# EAGLE design MoogFilter DIL (EAGLE 9.5.2)
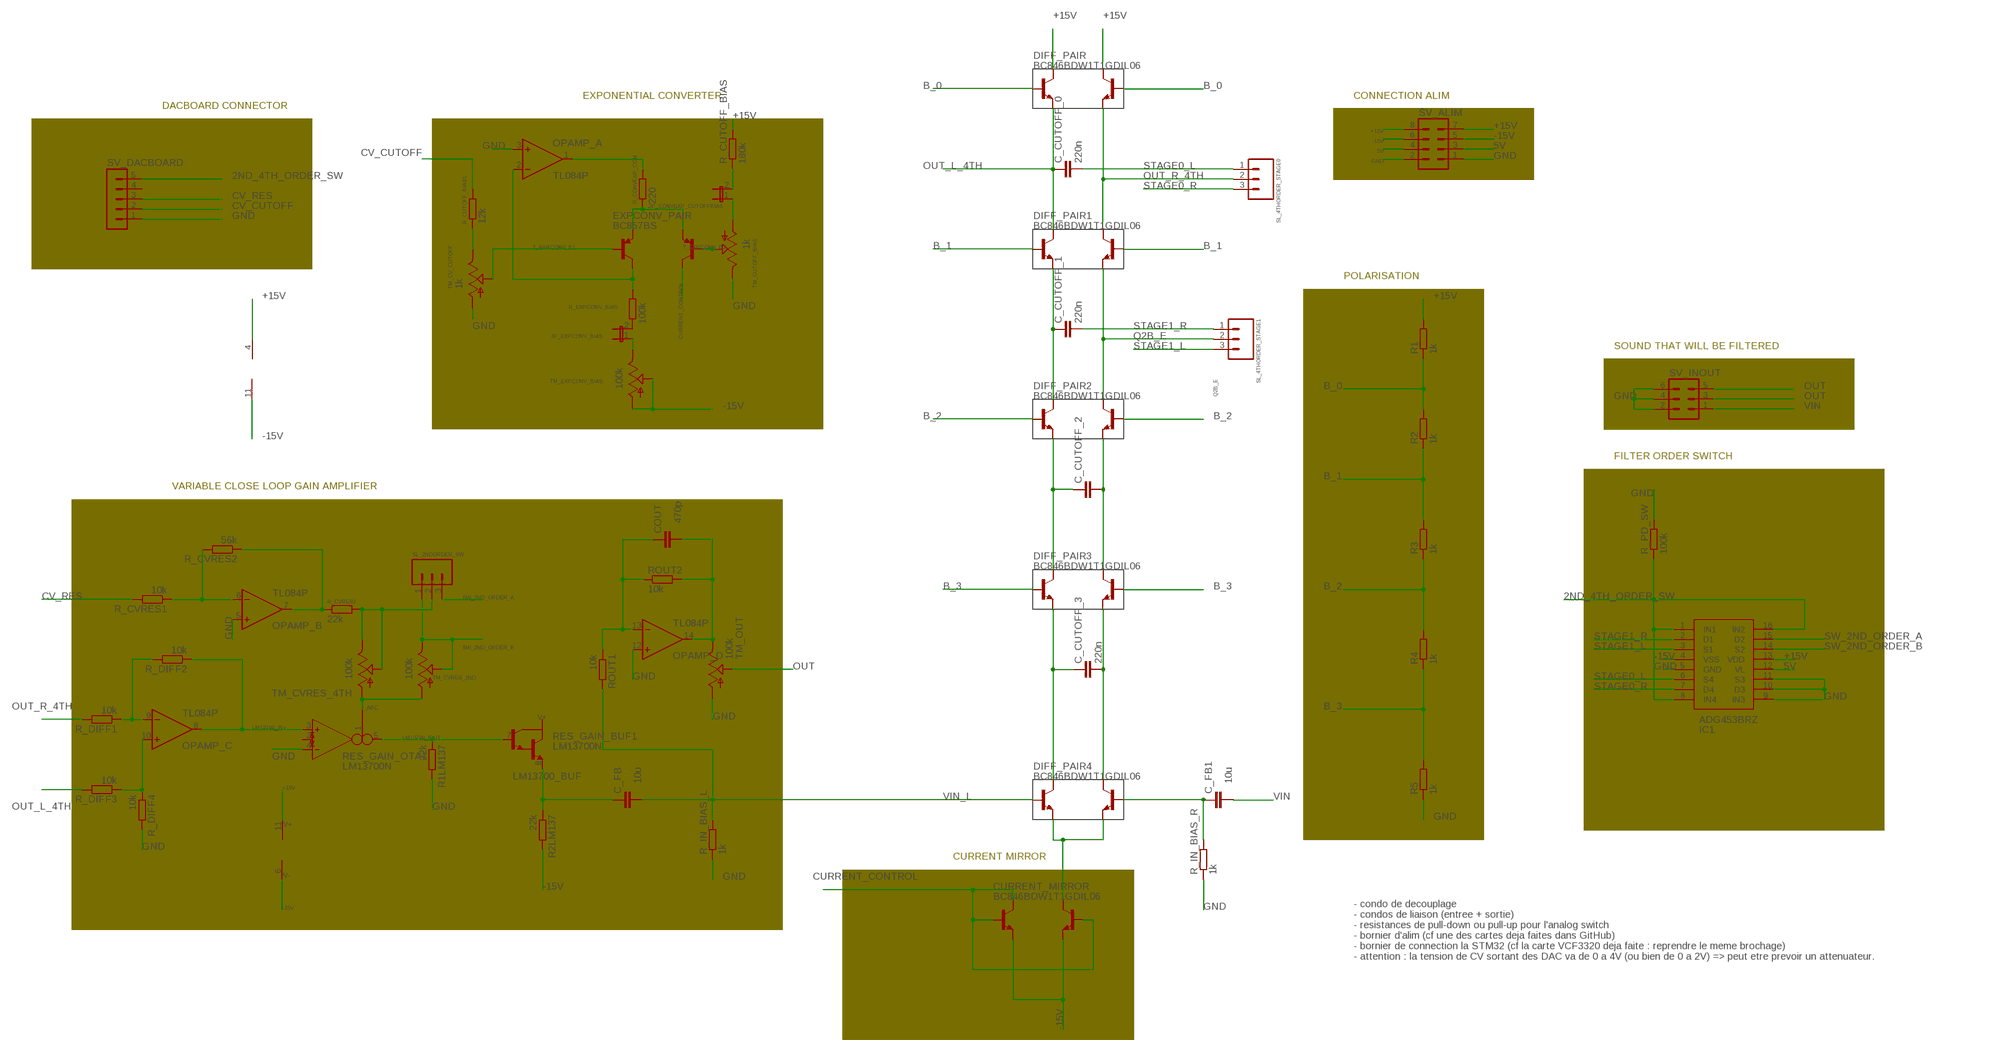
[diagram p0: schematic, sheet 1]

## Parts
C_CUTOFF_0  220n  C5/3  [C5B3]
C_CUTOFF_1  220n  C5/2.5  [C5B2.5]
C_CUTOFF_2  220n  C5/2.5  [C5B2.5]
C_CUTOFF_3  220n  C5/2.5  [C5B2.5]
C_FB  10u  C5/2.5  [C5B2.5]
C_FB1  10u  C5/2.5  [C5B2.5]
COUT  470p  C5/2.5  [C5B2.5]
CURRENT_MIRROR  BC846BDW1T1GDIL06  [DIL06]
DIFF_PAIR  BC846BDW1T1GDIL06  [DIL06]
DIFF_PAIR1  BC846BDW1T1GDIL06  [DIL06]
DIFF_PAIR2  BC846BDW1T1GDIL06  [DIL06]
DIFF_PAIR3  BC846BDW1T1GDIL06  [DIL06]
DIFF_PAIR4  BC846BDW1T1GDIL06  [DIL06]
EXPCONV_PAIR  BC857BS  [DIL06]
IC1  ADG453BRZ  [SOIC127P600X175-16N]
JP_CONVEXP_CUTOFFBIAS  JP1E  [JP1]
JP_EXPCONV_BIAS  JP1E  [JP1]
OPAMP_  TL084P  [DIL14]
R1  1k  R-EU_0204/7  [0204/7]
R1LM137  22k  R-EU_0204/7  [0204/7]
R2  1k  R-EU_0204/7  [0204/7]
R2LM137  22k  R-EU_0204/7  [0204/7]
R3  1k  R-EU_0204/7  [0204/7]
R4  1k  R-EU_0204/7  [0204/7]
R5  1k  R-EU_0204/7  [0204/7]
R_CONVEXP_COM  220  R-EU_0204/7  [0204/7]
R_CUTOFF_BIAS  180k  R-EU_0204/7  [0204/7]
R_CUTOFF_BIAS1  12k  R-EU_0204/7  [0204/7]
R_CVRES1  10k  R-EU_0204/7  [0204/7]
R_CVRES2  56k  R-EU_0204/7  [0204/7]
R_CVRES3  22k  R-EU_0204/7  [0204/7]
R_DIFF1  10k  R-EU_0204/7  [0204/7]
R_DIFF2  10k  R-EU_0204/7  [0204/7]
R_DIFF3  10k  R-EU_0204/7  [0204/7]
R_DIFF4  10k  R-EU_0204/7  [0204/7]
R_EXPCONV_BIAS  100k  R-EU_0204/7  [0204/7]
R_IN_BIAS_L  1k  R-EU_0204/7  [0204/7]
R_IN_BIAS_R  1k  R-EU_0204/7  [0204/7]
R_PD_SW  100k  R-EU_0204/7  [0204/7]
RES_GAIN_  LM13700N  [DIL16]
ROUT1  10k  R-EU_0204/7  [0204/7]
ROUT2  10k  R-EU_0204/7  [0204/7]
SL_2NDORDER_SW  MA03  [03P]
SL_4THORDER_STAGE0  MA03  [03P]
SL_4THORDER_STAGE1  MA03  [03P]
SV_ALIM  MA04-2  [MA04-2]
SV_DACBOARD  MA05-1  [MA05-1]
SV_INOUT  MA03-2  [MA03-2]
TM_CUTOFF_BIAS  1k  TRIM  [6MM]
TM_CV_CUTOFF  1k  TRIM  [6MM]
TM_CVRES_2ND  100k  TRIM  [6MM]
TM_CVRES_4TH  100k  TRIM  [6MM]
TM_EXPCONV_BIAS  100k  TRIM  [6MM]
TM_OUT  100k  TRIM  [6MM]

## Nets
2ND_4TH_ORDER_SW: IC1.1(IN1) IC1.8(IN4) IC1.16(IN2) R_PD_SW.1 SV_DACBOARD.5
5V: IC1.12(VL) SV_ALIM.3 SV_ALIM.4
+15V: DIFF_PAIR.3(C1) DIFF_PAIR.6(C2) IC1.13(VDD) OPAMP_.4(P:V+) R1.2 R_CUTOFF_BIAS.2 RES_GAIN_.11(SUPPLY:V+) SV_ALIM.7 SV_ALIM.8
-15V: CURRENT_MIRROR.1(E2) CURRENT_MIRROR.4(E1) IC1.4(VSS) OPAMP_.11(P:V-) R2LM137.2 RES_GAIN_.6(SUPPLY:V-) SV_ALIM.5 SV_ALIM.6 TM_EXPCONV_BIAS.A TM_EXPCONV_BIAS.S
B_0: DIFF_PAIR.2(B2) DIFF_PAIR.5(B1) R1.1 R2.2
B_1: DIFF_PAIR1.2(B2) DIFF_PAIR1.5(B1) R2.1 R3.2
B_2: DIFF_PAIR2.2(B2) DIFF_PAIR2.5(B1) R3.1 R4.2
B_3: DIFF_PAIR3.2(B2) DIFF_PAIR3.5(B1) R4.1 R5.2
CURRENT_CONTROL: CURRENT_MIRROR.2(B2) CURRENT_MIRROR.3(C1) CURRENT_MIRROR.5(B1) EXPCONV_PAIR.3(C2)
CV_CUTOFF: R_CUTOFF_BIAS1.2 SV_DACBOARD.2
CV_RES: R_CVRES1.2 SV_DACBOARD.3
GND: IC1.5(GND) IC1.9(IN3) IC1.10(D3) IC1.11(S3) OPAMP_.3(A:+IN) OPAMP_.5(B:+IN) OPAMP_.12(D:+IN) R1LM137.2 R5.1 R_DIFF4.2 R_IN_BIAS_L.1 R_IN_BIAS_R.1 R_PD_SW.2 RES_GAIN_.4(OTA1:IN_N) SV_ALIM.1 SV_ALIM.2 SV_DACBOARD.1 SV_INOUT.2 SV_INOUT.4 SV_INOUT.6 TM_CUTOFF_BIAS.E TM_CV_CUTOFF.A TM_OUT.A
I_ABC: RES_GAIN_.1(OTA1:I_BIAS) TM_CVRES_2ND.A TM_CVRES_4TH.A
LM13700_BUF: C_FB.1 R2LM137.1 RES_GAIN_.8(BUF1:E)
LM13700_IN+: OPAMP_.8(C:OUT) R_DIFF2.1 RES_GAIN_.3(OTA1:IN_P)
LM13700_IOUT: R1LM137.1 RES_GAIN_.5(OTA1:OUT) RES_GAIN_.7(BUF1:B)
N$1: COUT.1 OPAMP_.13(D:-IN) ROUT1.1 ROUT2.1
N$2: EXPCONV_PAIR.1(E1) EXPCONV_PAIR.4(E2) R_CONVEXP_COM.1
N$3: JP_CONVEXP_CUTOFFBIAS.2 R_CUTOFF_BIAS.1
N$4: OPAMP_.1(A:OUT) R_CONVEXP_COM.2
N$9: JP_CONVEXP_CUTOFFBIAS.1 TM_CUTOFF_BIAS.A
N$10: CURRENT_MIRROR.6(C2) DIFF_PAIR4.1(E2) DIFF_PAIR4.4(E1)
N$11: EXPCONV_PAIR.6(C1) OPAMP_.2(A:-IN) R_EXPCONV_BIAS.2
N$13: JP_EXPCONV_BIAS.2 R_EXPCONV_BIAS.1
N$14: OPAMP_.6(B:-IN) R_CVRES1.1 R_CVRES2.2
N$16: OPAMP_.7(B:OUT) R_CVRES2.1 R_CVRES3.1
N$18: OPAMP_.10(C:+IN) R_DIFF3.1 R_DIFF4.1
N$20: OPAMP_.9(C:-IN) R_DIFF1.1 R_DIFF2.2
N$24: COUT.2 OPAMP_.14(D:OUT) ROUT2.2 TM_OUT.E
N$25: JP_EXPCONV_BIAS.1 TM_EXPCONV_BIAS.E
N$26: R_CVRES3.2 SL_2NDORDER_SW.2 TM_CVRES_4TH.E TM_CVRES_4TH.S
N$29: R_CUTOFF_BIAS1.1 TM_CV_CUTOFF.E
OUT: SV_INOUT.3 SV_INOUT.5 TM_OUT.S
OUT_L_4TH: C_CUTOFF_0.1 DIFF_PAIR1.3(C1) DIFF_PAIR.4(E1) R_DIFF3.2
OUT_R_4TH: DIFF_PAIR1.6(C2) DIFF_PAIR.1(E2) R_DIFF1.2 SL_4THORDER_STAGE0.2
Q2A_E: C_CUTOFF_1.1 DIFF_PAIR1.4(E1) DIFF_PAIR2.3(C1)
Q2B_E: DIFF_PAIR1.1(E2) DIFF_PAIR2.6(C2) SL_4THORDER_STAGE1.2
Q3A_E: C_CUTOFF_2.1 DIFF_PAIR2.4(E1) DIFF_PAIR3.3(C1)
Q3B_E: C_CUTOFF_2.2 DIFF_PAIR2.1(E2) DIFF_PAIR3.6(C2)
Q4A_E: C_CUTOFF_3.1 DIFF_PAIR3.4(E1) DIFF_PAIR4.3(C1)
Q4B_E: C_CUTOFF_3.2 DIFF_PAIR3.1(E2) DIFF_PAIR4.6(C2)
STAGE0_L: C_CUTOFF_0.2 IC1.6(S4) SL_4THORDER_STAGE0.1
STAGE0_R: IC1.7(D4) SL_4THORDER_STAGE0.3
STAGE1_L: IC1.3(S1) SL_4THORDER_STAGE1.3
STAGE1_R: C_CUTOFF_1.2 IC1.2(D1) SL_4THORDER_STAGE1.1
SW_2ND_ORDER_A: IC1.15(D2) SL_2NDORDER_SW.3
SW_2ND_ORDER_B: IC1.14(S2) SL_2NDORDER_SW.1 TM_CVRES_2ND.E TM_CVRES_2ND.S
T_EXPCONV_B1: EXPCONV_PAIR.2(B1) TM_CV_CUTOFF.S
T_EXPCONV_B2: EXPCONV_PAIR.5(B2) TM_CUTOFF_BIAS.S
VIN: C_FB1.2 SV_INOUT.1
VIN_L: C_FB.2 DIFF_PAIR4.5(B1) R_IN_BIAS_L.2 ROUT1.2
VIN_R: C_FB1.1 DIFF_PAIR4.2(B2) R_IN_BIAS_R.2
Unconnected: RES_GAIN_.2(OTA1:I_DIODE) RES_GAIN_.9(BUF2:E) RES_GAIN_.10(BUF2:B) RES_GAIN_.12(OTA2:OUT) RES_GAIN_.13(OTA2:IN_N) RES_GAIN_.14(OTA2:IN_P) RES_GAIN_.15(OTA2:I_DIODE) RES_GAIN_.16(OTA2:I_BIAS) SV_DACBOARD.4

## Notes on the sheet
- EXPONENTIAL CONVERTER | CONNECTION ALIM
- DACBOARD CONNECTOR
- POLARISATION
- SOUND THAT WILL BE FILTERED
- Jumpers here allow, once opened, 
  on-circuit trimmer values measurement.
- FILTER ORDER SWITCH
- VARIABLE CLOSE LOOP GAIN AMPLIFIER | SWITCHER
- SWITCHER | SWITCHER | SWITCHER
- 1 and 4 are closed with input HIGH
  2 and 3 are closed with input LOW
  
  Control is LOW => 2ND ORDER
  Control is HIGH => 4TH ORDER
- CURRENT MIRROR
- - condo de decouplage
  - condos de liaison (entree + sortie)
  - resistances de pull-down ou pull-up pour l'analog switch
  - bornier d'alim (cf une des cartes deja faites dans GitHub)
  - bornier de connection la STM32 (cf la carte VCF3320 deja faite : reprendre le meme brochage)
  - attention : la tension de CV sortant des DAC va de 0 a 4V (ou bien de 0 a 2V) => peut etre prevoir un attenuateur.

## Library data of the parts
C_CUTOFF_0 C_CUTOFF_1-C_CUTOFF_3 C_FB C_FB1 COUT = capacitor-wima:C: CAPACITOR naming: grid - package width
CURRENT_MIRROR DIFF_PAIR DIFF_PAIR1-DIFF_PAIR4 = paires_diff:BC846BDW1T1G
EXPCONV_PAIR = paires_diff:BC857BS
IC1 = ADG453BRZ:ADG453BRZ: Analog Devices ADG453BRZ, Analogue SPST Switch Quad SPST, 9 V, 16-Pin SOIC Source: Datasheet <http://uk.rs-online.com/web/p/products/0412539P>; DESCRIPTION: Analog Devices ADG453BRZ, Analogue SPST Switch Quad SPST, 9 V, 16-Pin SOIC; HEIGHT: 1.75mm; MANUFACTURER_NAME: Analog Devices; MANUFACTURER_PART_NUMBER: ADG453BRZ; MOUSER_PART_NUMBER: 584-ADG453BRZ; MOUSER_PRICE-STOCK: https://www.mouser.com/Search/Refine.aspx?Keyword=584-ADG453BRZ; RS_PART_NUMBER: 0412539P; RS_PRICE-STOCK: http://uk.rs-online.com/web/p/products/0412539P
JP_CONVEXP_CUTOFFBIAS JP_EXPCONV_BIAS = jumper:JP1E: JUMPER
OPAMP_ = linear:TL084: OP AMP
R1 R1LM137 R2 R2LM137 R3-R5 R_CONVEXP_COM R_CUTOFF_BIAS R_CUTOFF_BIAS1 R_CVRES1-R_CVRES3 R_DIFF1-R_DIFF4 R_EXPCONV_BIAS R_IN_BIAS_L R_IN_BIAS_R R_PD_SW ROUT1 ROUT2 = rcl:R-EU_: RESISTOR, European symbol; SPICEPREFIX: R
RES_GAIN_ = ota:LM13700: Dual OTA with buffers
SL_2NDORDER_SW SL_4THORDER_STAGE0 SL_4THORDER_STAGE1 = con-amp-quick:MA03: AMP QUICK CONNECTOR; OC_FARNELL: unknown; OC_NEWARK: unknown
SV_ALIM = con-lstb:MA04-2: PIN HEADER; OC_FARNELL: unknown; OC_NEWARK: unknown
SV_DACBOARD = con-lstb:MA05-1: PIN HEADER; OC_FARNELL: unknown; OC_NEWARK: unknown
SV_INOUT = con-lstb:MA03-2: PIN HEADER; OC_FARNELL: unknown; OC_NEWARK: unknown
TM_CUTOFF_BIAS TM_CV_CUTOFF TM_CVRES_2ND TM_CVRES_4TH TM_EXPCONV_BIAS TM_OUT = adafruit:TRIM

## Board
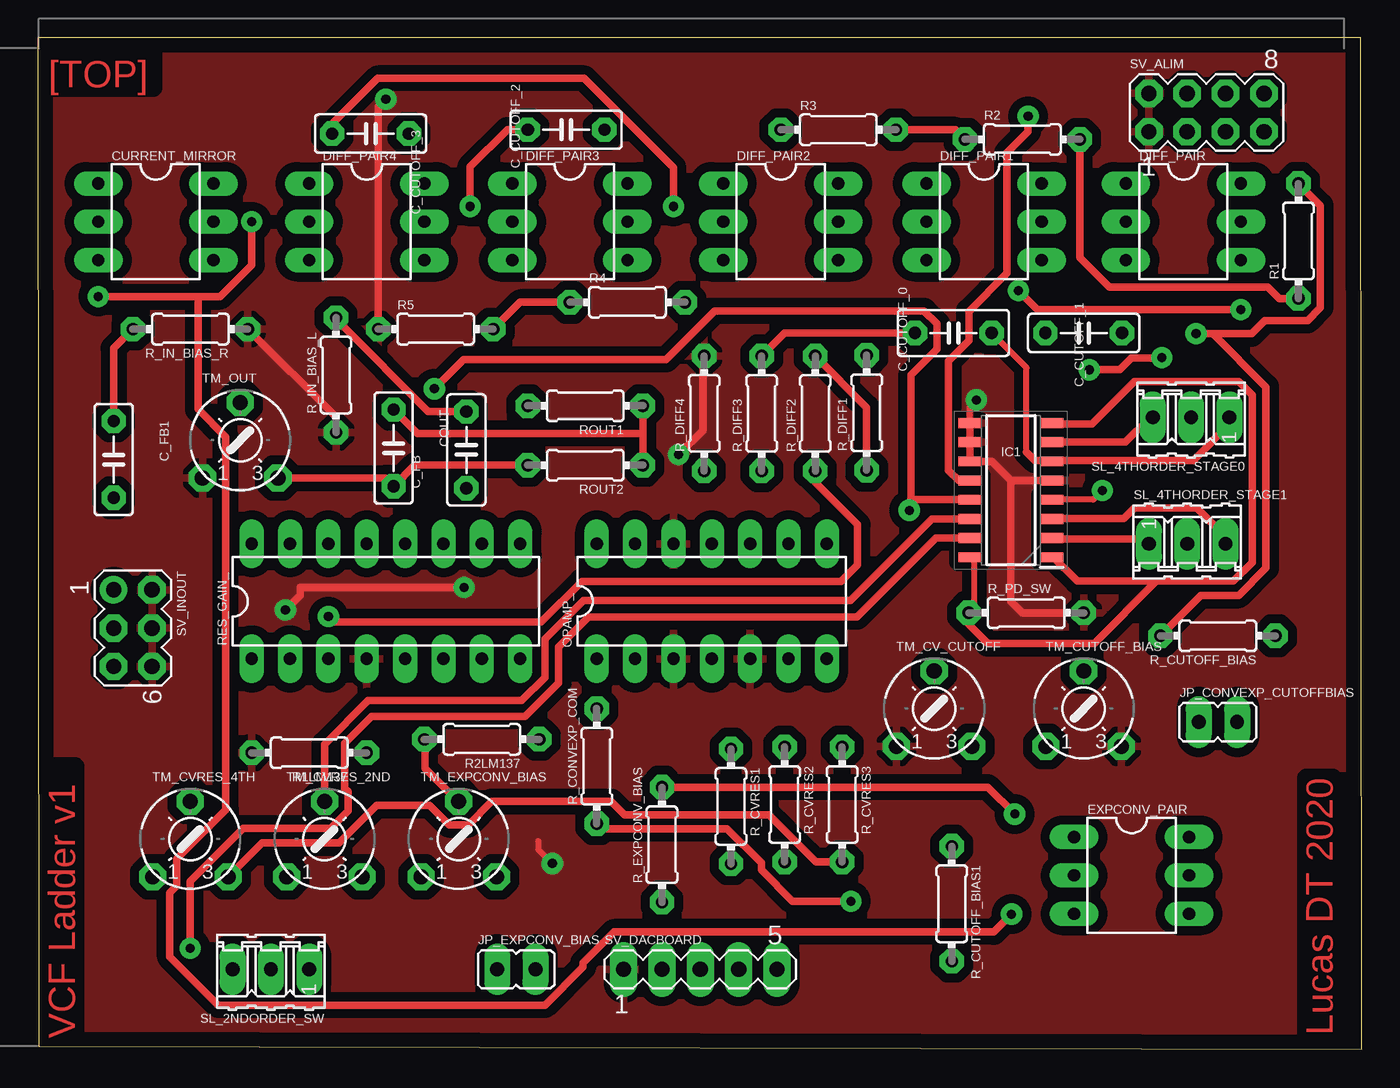
[diagram p1: board, top side]
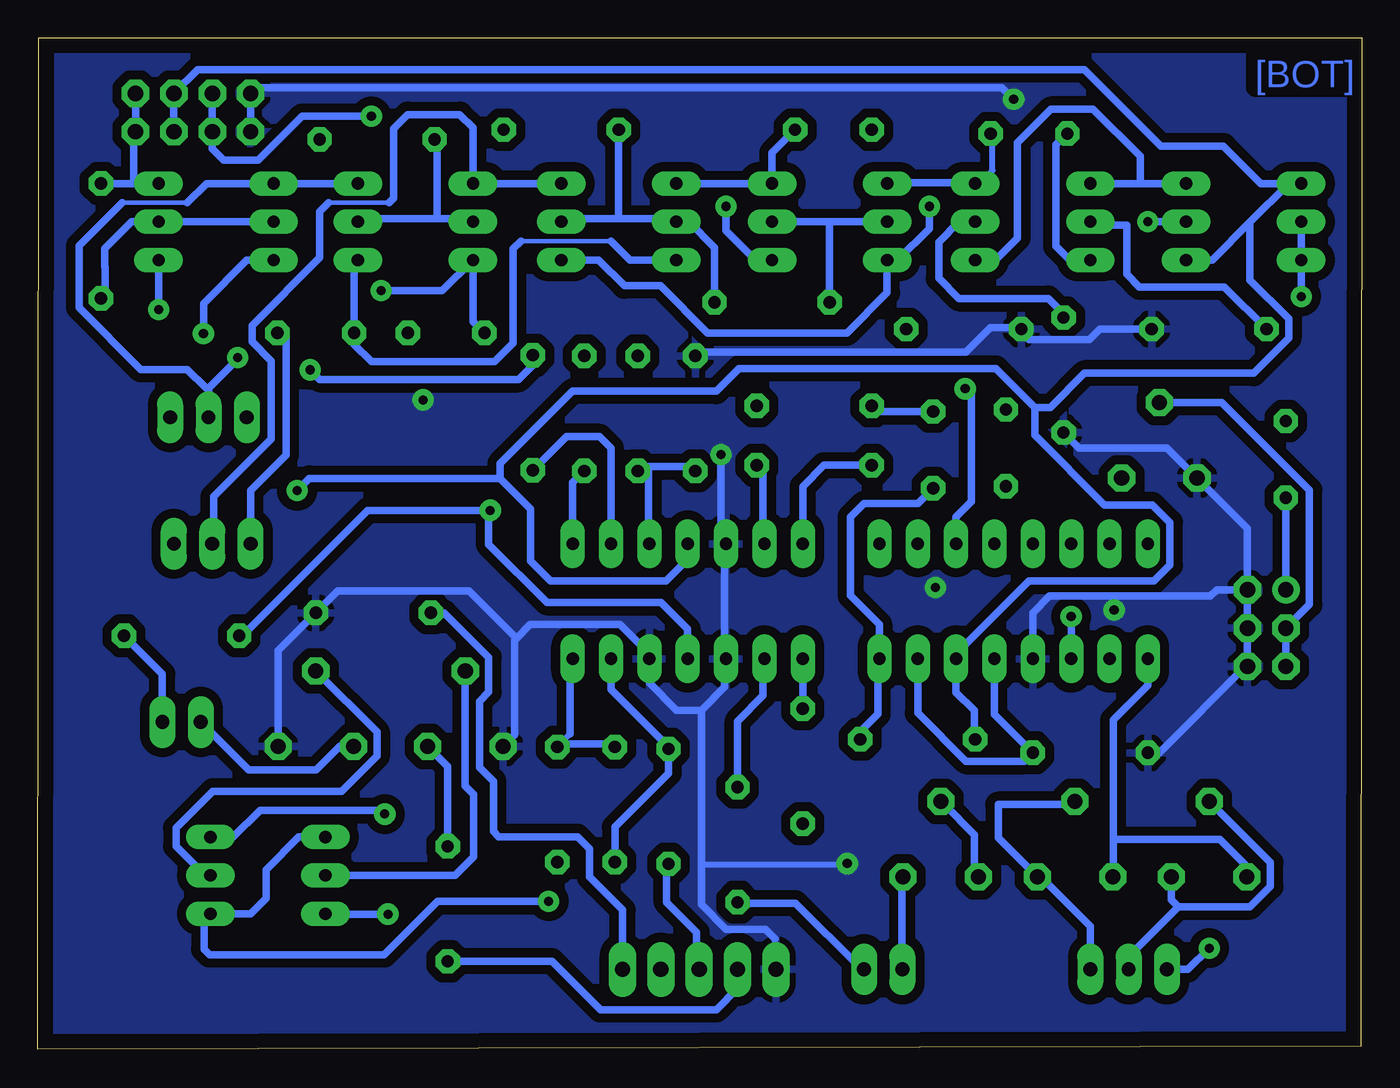
[diagram p2: board, bottom side, seen from below]

Size 87.71 x 67.01 mm. Coordinates in mm from the lower left corner, seen from the top.
Outline: 0.08,0.2 87.71,0 87.64,67.01 0,67.01 0.08,0.2
Copper layers (1*16): Top 0.035mm / dielectric 1.5mm / Bottom 0.035mm
Design rules "ENSEA_2019": minimum track width 0.4mm, minimum drill 0.6mm, track to track 0.4mm, track to pad 0.4mm, pad to pad 0.4mm, via to via 0.4mm, smd to smd 0.4mm, copper to edge 1mm, drill to drill 0.4mm, minimum pad ring 0.4mm, minimum via ring 0.4mm, stop-mask expansion 4mil, vias tented up to drill 0mil, thermal gap 0.4mm

### Footprints (pad centres in the part's own frame; a part is rotated, then mirrored left to right if it is on the bottom)
C5B3 = drill 0.813 pad 1.6 octagon: 1 -2.54,0; 2 2.54,0
C5B2.5 = drill 0.813 pad 1.6 octagon: 1 -2.54,0; 2 2.54,0
DIL06 = drill 0.813 long: 1 -2.54,-3.81; 2 0,-3.81; 3 2.54,-3.81; 4 2.54,3.81; 5 0,3.81; 6 -2.54,3.81
SOIC127P600X175-16N = smd 1.525 x 0.65: 1 -2.712,4.445; 2 -2.712,3.175; 3 -2.712,1.905; 4 -2.712,0.635; 5 -2.712,-0.635; 6 -2.712,-1.905; 7 -2.712,-3.175; 8 -2.712,-4.445; 9 2.712,-4.445; 10 2.712,-3.175; 11 2.712,-1.905; 12 2.712,-0.635; 13 2.712,0.635; 14 2.712,1.905; 15 2.712,3.175; 16 2.712,4.445
JP1 = drill 0.914 long: 1 0,-1.27; 2 0,1.27
DIL14 = drill 0.813 long: 1 -7.62,-3.81; 2 -5.08,-3.81; 3 -2.54,-3.81; 4 0,-3.81; 5 2.54,-3.81; 6 5.08,-3.81; 7 7.62,-3.81; 8 7.62,3.81; 9 5.08,3.81; 10 2.54,3.81; 11 0,3.81; 12 -2.54,3.81; 13 -5.08,3.81; 14 -7.62,3.81
0204/7 = drill 0.813 octagon: 1 -3.81,0; 2 3.81,0
DIL16 = drill 0.813 long: 1 -8.89,-3.81; 2 -6.35,-3.81; 3 -3.81,-3.81; 4 -1.27,-3.81; 5 1.27,-3.81; 6 3.81,-3.81; 7 6.35,-3.81; 8 8.89,-3.81; 9 8.89,3.81; 10 6.35,3.81; 11 3.81,3.81; 12 1.27,3.81; 13 -1.27,3.81; 14 -3.81,3.81; 15 -6.35,3.81; 16 -8.89,3.81
03P = drill 0.914 long: 1 -2.54,0; 2 0,0; 3 2.54,0
MA04-2 = drill 1.016 octagon: 1 -3.81,-1.27; 2 -3.81,1.27; 3 -1.27,-1.27; 4 -1.27,1.27; 5 1.27,-1.27; 6 1.27,1.27; 7 3.81,-1.27; 8 3.81,1.27
MA05-1 = drill 1.016 long: 1 -5.08,0; 2 -2.54,0; 3 0,0; 4 2.54,0; 5 5.08,0
MA03-2 = drill 1.016: 1 -2.54,-1.27 | drill 1.016 octagon: 2 -2.54,1.27; 3 0,-1.27; 4 0,1.27; 5 2.54,-1.27; 6 2.54,1.27
6MM = drill 1 pad 1.676 octagon: A -2.5,-2.5; E 2.5,-2.5; S 0,2.5

### Placement (x,y rotation side)
C_CUTOFF_0  60.66,47.45 0 top
C_CUTOFF_1  69.29,47.45 0 top
C_CUTOFF_2  35,60.91 0 top
C_CUTOFF_3  22.05,60.66 0 top
C_FB  28.4,39.7 90 top
C_FB1  5.03,39.07 270 top
COUT  23.57,39.83 270 top
CURRENT_MIRROR  7.82,54.81 270 top
DIFF_PAIR  75.9,54.81 270 top
DIFF_PAIR1  62.69,54.81 270 top
DIFF_PAIR2  49.23,54.81 270 top
DIFF_PAIR3  35.26,54.81 270 top
DIFF_PAIR4  21.79,54.81 270 top
EXPCONV_PAIR  72.47,11.51 270 top
IC1  64.47,37.03 180 top
JP_CONVEXP_CUTOFFBIAS  78.18,21.67 270 top
JP_EXPCONV_BIAS  31.7,5.28 270 top
OPAMP_  44.65,29.67 0 top
R1  83.52,53.54 90 top
R1LM137  17.98,19.63 180 top
R2  65.23,60.27 0 top
R2LM137  29.41,20.52 180 top
R3  53.04,60.91 0 top
R4  39.07,49.48 0 top
R5  26.37,47.7 0 top
R_CONVEXP_COM  37.03,18.75 90 top
R_CUTOFF_BIAS  78.18,27.38 180 top
R_CUTOFF_BIAS1  60.55,9.63 270 top
R_CVRES1  45.92,16.08 270 top
R_CVRES2  49.48,16.21 270 top
R_CVRES3  53.29,16.21 270 top
R_DIFF1  54.91,42.16 90 top
R_DIFF2  51.51,42.11 90 top
R_DIFF3  47.96,42.11 90 top
R_DIFF4  44.15,42.11 90 top
R_EXPCONV_BIAS  41.35,13.54 90 top
R_IN_BIAS_L  19.76,44.65 90 top
R_IN_BIAS_R  10.11,47.7 180 top
R_PD_SW  65.48,28.91 0 top
RES_GAIN_  23.06,29.67 0 top
ROUT1  36.27,42.62 180 top
ROUT2  36.27,38.68 180 top
SL_2NDORDER_SW  15.44,5.28 180 top
SL_4THORDER_STAGE0  76.4,41.86 180 top
SL_4THORDER_STAGE1  76.15,33.48 0 top
SV_ALIM  77.42,62.05 0 top
SV_DACBOARD  43.89,5.28 0 top
SV_INOUT  6.3,27.89 270 top
TM_CUTOFF_BIAS  69.29,22.56 0 top
TM_CV_CUTOFF  59.39,22.56 0 top
TM_CVRES_2ND  19,13.92 0 top
TM_CVRES_4TH  10.11,13.92 0 top
TM_EXPCONV_BIAS  27.89,13.92 0 top
TM_OUT  13.41,40.34 0 top

### Tracks (layer width: path | path; a pad name or v marks a point on that pad's centre or on a via)
2ND_4TH_ORDER_SW
  Top 0.4: R_PD_SW.1 62.06,29 62.06,32.6 IC1.16 | 66.86,32.6 IC1.1 67.26,32.6 | 67.26,41.4 IC1.8
  Top 0.508: 67.26,41.4 69.82,41.4 72.65,44.23 79.57,44.23 80.45,43.34 80.45,32.25 79.21,31 74.12,31 | 74.12,31 68.86,31 67.26,32.6 | R_PD_SW.1 61.67,28.14 62.94,26.87 69.99,26.87 74.12,31
  Bottom 0.508: SV_DACBOARD.5 48.97,9.22 50.66,10.91 51.15,11.4 51.15,13.26 51.96,14.07 57.18,14.07 57.53,14.43 57.53,17.74 58.44,18.65 58.44,23.04 57.83,23.65 57.83,25.95 60.78,28.91 R_PD_SW.1
5V  (via drill 0.6)
  Top 0.4: 61.66,37.8 IC1.12
  Top 0.508: v65.61,61.8 65.61,60.78 64.21,59.39 64.21,51.39 61.68,48.87 61.68,46.93 60.34,45.59 60.34,38.34 61.01,37.67 IC1.12
  Bottom 0.508: SV_ALIM.4 SV_ALIM.3 76.15,59.64 75.39,58.88 73.1,58.88 70.18,61.8 v65.61,61.8
+15V  (via drill 0.6)
  Top 0.508: v26.28,43.75 28.22,45.7 41.63,45.7 44.84,48.91 58.72,48.91 59.58,48.05 59.58,46.37 57.86,44.65 57.86,36.37 | 57.86,36.37 57.86,35.82 v57.73,35.7 | R1.2 84.98,55.89 84.98,49.13 84.12,48.27 81.29,48.27 80.42,47.4 v76.74,47.4 v76.73,47.4 77.83,47.4 81.36,43.87 81.36,31.87 79.56,30.07 77.06,30.07 R_CUTOFF_BIAS.2 | 57.86,36.37 57.89,36.4 IC1.13
  Bottom 0.508: SV_ALIM.8 SV_ALIM.7 81.36,60.66 81.36,57.35 | OPAMP_.4 44.65,27.83 46.43,29.6 53.98,29.6 57.83,33.45 57.83,35.6 v57.73,35.7 65.85,35.7 74.17,27.38 R_CUTOFF_BIAS.2 | DIFF_PAIR.3 73.86,52.27 76.73,49.4 v76.73,47.4 | R1.2 81.36,57.35 | 81.36,57.35 DIFF_PAIR.6 | RES_GAIN_.11 26.87,35.26 25.86,36.27 25.86,43.33 v26.28,43.75
-15V  (via drill 0.6)
  Top 0.4: 25.66,20.24 R2LM137.2 | 27.66,16.6 TM_EXPCONV_BIAS.S | v70.53,37 69.92,36.4 IC1.4
  Top 0.508: 25.66,20.24 25.66,18.6 27.66,16.6
  Bottom 0.4: 25.66,20.64 R2LM137.2 | TM_EXPCONV_BIAS.S 27.66,16.2
  Bottom 0.508: 57.08,37.8 69.73,37.8 v70.53,37 | 57.08,37.8 55.07,35.8 55.07,32.33 53.75,31 46.1,31 44.65,32.45 OPAMP_.11 | 27.66,16.2 25.66,14.2 25.66,11.69 TM_EXPCONV_BIAS.A | SV_ALIM.5 SV_ALIM.6 77.13,64.88 18.36,64.88 13.31,59.83 9.16,59.83 6.68,57.35 CURRENT_MIRROR.1 4.82,57.35 7.4,54.77 | 25.66,20.64 25.66,22.43 26.87,23.64 RES_GAIN_.6 26.87,26.19 22.06,31 13.78,31 12.71,32.07 12.71,34.89 13.88,36.06 17.04,36.06 21.66,40.67 21.66,42.52 | 21.66,42.52 24.24,45.1 41.25,45.1 42.76,43.59 52.27,43.59 57.08,38.78 57.08,37.8 | 7.4,54.77 9.9,52.27 CURRENT_MIRROR.4 | 7.4,54.77 7.4,50.96 4.84,48.4 4.84,47.1 7.16,44.78 18.36,44.78 20.63,42.52 21.66,42.52
B_0
  Top 0.508: R1.1 82.26,49.73 81.49,50.5 70.99,50.5 69.04,52.45 R2.2
  Bottom 0.4: 79.66,55 DIFF_PAIR.5
  Bottom 0.508: R1.1 83.26,49.8 83.26,51.8 83.26,51.81 83.26,53.04 81.48,54.81 DIFF_PAIR.5 DIFF_PAIR.2
B_1
  Top 0.508: R2.1 60.78,60.91 R3.2
  Bottom 0.4: 66.46,55 DIFF_PAIR1.5 | R2.1 61.26,60.12
  Bottom 0.508: 66.46,55 61.26,55 | 61.26,55 59.26,55 DIFF_PAIR1.2 | 61.26,60.12 61.26,55
B_2
  Bottom 0.4: 52.86,55 DIFF_PAIR2.5 | 45.66,55 DIFF_PAIR2.2
  Bottom 0.508: 45.66,55 49.23,55 | 49.23,55 52.86,55 | 49.23,55 R3.1 | DIFF_PAIR2.2 44.58,54.81 42.88,53.11 R4.2
B_3
  Top 0.508: R4.1 31.95,49.48 R5.2
  Bottom 0.508: DIFF_PAIR3.5 35.26,54.81 | 35.26,54.81 DIFF_PAIR3.2 | 35.26,54.81 R4.1
CURRENT_CONTROL  (via drill 0.6)
  Top 0.508: v4.01,49.86 10.62,49.86 | v64.51,8.94 63.33,7.75 38.16,7.75 36.13,5.72 36.13,5.45 33.6,2.92 11.96,2.92 8.76,6.12 8.76,10.37 9.2,10.81 9.2,12.6 12.47,15.86 12.47,40.55 10.62,42.4 10.62,49.86 | 10.62,49.86 12.09,49.86 14.17,51.94 v14.17,54.81
  Bottom 0.508: v64.51,8.94 68.63,8.94 EXPCONV_PAIR.3 | v14.17,54.81 CURRENT_MIRROR.5 | CURRENT_MIRROR.2 CURRENT_MIRROR.3 v4.01,49.86
CV_CUTOFF
  Bottom 0.508: SV_DACBOARD.2 41.35,4.01 42.75,2.62 50.44,2.62 53.65,5.82 R_CUTOFF_BIAS1.2
CV_RES
  Bottom 0.4: 44.06,5.4 SV_DACBOARD.3
  Bottom 0.508: 44.06,5.4 44.06,7.73 46.06,9.73 46.06,12.2 R_CVRES1.2
GND  (via drill 0.6)
  Top 0.4: 44.06,45.8 R_DIFF4.2 | v34.09,12.29 33.17,13.21 33.17,13.79 | v16.41,29.08 16.46,29.13 16.48,29.13 | IC1.9 61.75,42.59 v62.18,43.01
  Top 0.508: IC1.5 67.17,37.68 64.46,37.68 | 44.06,45.8 44.06,40.98 v42.46,39.38 | 64.46,37.68 63.2,38.94 IC1.11 IC1.10 IC1.9 | R_IN_BIAS_R.1 19.76,41.86 R_IN_BIAS_L.1 | 64.46,37.68 64.47,37.67 64.47,29.67 65.23,28.91 R_PD_SW.2 | R5.1 22.56,62.44 v23.06,62.94 | v16.41,29.08 17.37,30.05 17.37,30.58 v28.25,30.58
  Bottom 0.4: 71.66,20.17 TM_CUTOFF_BIAS.E | 42.2,25.95 OPAMP_.3 | 42.46,33.8 OPAMP_.12 | 38.86,7.32 38.86,5.4 SV_DACBOARD.1 | 7.66,30.2 SV_INOUT.2 | 7.66,25.4 SV_INOUT.6 | 20.06,41 R_IN_BIAS_L.1 | 22.46,47.4 R5.1 22.86,47.8 | R_PD_SW.2 69.29,29.37 | 43.75,12.24 34.14,12.24 v34.09,12.29 | 16.28,30.01 16.41,29.88 v16.41,29.08 | v62.18,43.01 62.18,43.05
  Bottom 0.508: OPAMP_.12 42.2,33.46 42.2,25.95 42.2,23.99 43.75,22.44 | v42.46,39.38 42.46,33.8 | 22.86,47.8 24.59,47.8 26.22,46.18 43.89,46.18 R_DIFF4.2 | SV_ALIM.1 SV_ALIM.2 73.23,63.32 72.85,63.71 23.83,63.71 v23.06,62.94 | SV_INOUT.2 7.57,34.49 TM_OUT.A 12.9,39.83 18.75,39.83 R_IN_BIAS_L.1 | TM_CV_CUTOFF.A 56.12,20.82 56.12,27.09 56,27.21 | TM_CUTOFF_BIAS.E 71.79,26.41 R_PD_SW.2 67.83,30.37 59.15,30.37 56,27.21 | 38.86,7.32 39.49,7.95 42.11,7.95 43.75,9.59 43.75,12.24 43.75,22.44 | 56,27.21 55.09,28.12 49.13,28.12 47.19,26.19 OPAMP_.5 47.19,24.26 45.38,22.44 43.75,22.44 | SV_INOUT.2 SV_INOUT.4 7.57,25.49 7.66,25.4 13.43,19.63 R1LM137.2 | RES_GAIN_.4 21.79,28.91 20.69,30.01 16.28,30.01 10.03,30.01 9.6,30.43 SV_INOUT.2 | R_IN_BIAS_R.1 17.36,47.7 18.06,47 22.06,47 22.46,47.4
  pour Bottom (isolate 0.61): 0.2,66.24 86.56,66.24 86.56,0.2 0.46,0.2 0.2,0.46
  pour Top (isolate 0.61): 0.2,66.5 86.56,66.5 86.56,0.2 -0.05,0.2 -0.05,66.24
I_ABC
  Bottom 0.4: 16.46,11.8 TM_CVRES_2ND.A
  Bottom 0.508: RES_GAIN_.1 14.17,24.08 16.46,21.8 16.46,13.89 | 16.46,11.8 16.46,13.89 | TM_CVRES_4TH.A 7.61,12.11 9.39,13.89 16.46,13.89
LM13700_BUF
  Bottom 0.4: 32.06,25.8 RES_GAIN_.8
  Bottom 0.508: R2LM137.1 33.22,21.04 32.06,22.2 32.06,25.8 | RES_GAIN_.8 31.95,28.14 33.86,30.05 33.86,35.26 32.97,36.14 29.41,36.14 C_FB.1
LM13700_IN+  (via drill 0.6)
  Top 0.508: v19.25,28.65 19.61,28.3 33.35,28.3 36.04,30.99 53.21,30.99 54.31,32.08 54.31,34.75 51.51,37.54 R_DIFF2.1
  Bottom 0.508: v19.25,28.65 RES_GAIN_.3 | R_DIFF2.1 52.27,37.54 OPAMP_.8
LM13700_IOUT
  Bottom 0.508: RES_GAIN_.5 24.33,22.17 R1LM137.1 22.36,19.06 26.21,19.06 29.41,22.27 RES_GAIN_.7
N$1
  Top 0.508: ROUT1.1 40.08,40.78 | 40.08,40.78 ROUT2.1 | 40.08,40.78 25.16,40.78 COUT.1
  Bottom 0.4: 39.66,33.8 OPAMP_.13
  Bottom 0.508: ROUT2.1 39.66,38.26 39.66,33.8
N$2  (via drill 0.6)
  Top 0.4: 37.37,14.6 R_CONVEXP_COM.1
  Top 0.508: v53.87,9.8 50.01,9.8 47.93,11.88 47.93,12.33 45.65,14.6 37.37,14.6
  Bottom 0.508: EXPCONV_PAIR.1 70.43,14.05 72.59,11.89 72.59,9.98 73.61,8.97 EXPCONV_PAIR.4 76.7,8.54 76.7,6.62 76.34,6.26 64.76,6.26 61.22,9.8 v53.87,9.8 53.87,9.77
N$3
  Bottom 0.508: R_CUTOFF_BIAS.1 79.45,24.84 JP_CONVEXP_CUTOFFBIAS.2
N$4
  Bottom 0.508: OPAMP_.1 R_CONVEXP_COM.2
N$9
  Bottom 0.508: TM_CUTOFF_BIAS.A 67.71,20.06 69.26,18.5 73.75,18.5 JP_CONVEXP_CUTOFFBIAS.1
N$10
  Bottom 0.508: CURRENT_MIRROR.6 14.68,57.35 | 14.68,57.35 DIFF_PAIR4.1 | 14.68,57.35 14.68,59.15 17.8,62.27 20.58,62.27 22.81,60.04 22.81,53.73 24.27,52.27 DIFF_PAIR4.4
N$11  (via drill 0.6)
  Top 0.508: v64.72,15.57 62.94,17.35 R_EXPCONV_BIAS.2
  Bottom 0.4: 39.66,25.8 OPAMP_.2
  Bottom 0.508: R_EXPCONV_BIAS.2 41.35,21.72 39.66,23.42 39.66,25.8 | v64.72,15.57 64.97,15.82 72.97,15.82 74.75,14.05 EXPCONV_PAIR.6
N$13
  Bottom 0.4: 41.31,9.66 R_EXPCONV_BIAS.1 | 33.26,5.4 JP_EXPCONV_BIAS.2
  Bottom 0.508: 41.31,9.66 37.52,9.66 33.26,5.4
N$14
  Bottom 0.508: OPAMP_.6 49.73,23.83 45.92,20.02 R_CVRES1.1 45.92,18.27 49.48,14.71 R_CVRES2.2
N$16
  Bottom 0.4: 49.66,20.2 R_CVRES2.1 | 53.07,20.2 R_CVRES3.1 52.46,20.87
  Bottom 0.508: 53.07,20.2 49.66,20.2 | 52.46,20.87 52.46,25.8 OPAMP_.7
N$18
  Bottom 0.4: 47.66,38.6 47.26,38.6 R_DIFF3.1
  Bottom 0.508: R_DIFF4.1 44.46,38.6 47.26,38.6 47.26,33.8 OPAMP_.10 | 47.66,38.6 R_DIFF3.1
N$20
  Top 0.508: R_DIFF2.2 54.92,42.52 R_DIFF1.1
  Bottom 0.508: OPAMP_.9 49.73,39.83 50.48,40.58 52.69,40.58 R_DIFF1.1
N$24
  Top 0.508: TM_OUT.E 23.02,37.84 COUT.2 24.97,38.68 ROUT2.2
  Bottom 0.508: OPAMP_.14 37.03,37.29 35.64,38.68 ROUT2.2
N$25
  Bottom 0.4: 30.46,5.4 JP_EXPCONV_BIAS.1 | 30.46,11.4 TM_EXPCONV_BIAS.E
  Bottom 0.508: 30.46,11.4 30.46,5.4
N$26
  Top 0.508: R_CVRES3.2 51.54,12.4 48.43,15.51 38.87,15.51 37.99,16.4 30.06,16.4 28.53,14.87 27.25,14.87 25.96,16.15 22.45,16.15 19.96,13.67 14.86,13.67 TM_CVRES_4TH.E
  Bottom 0.508: SL_2NDORDER_SW.2 15.44,6.14 12.16,9.43 | TM_CVRES_4TH.E 12.61,9.88 12.16,9.43 | 12.16,9.43 7.4,9.43 6.06,10.78 6.06,12.37 TM_CVRES_4TH.S
N$29
  Bottom 0.508: TM_CV_CUTOFF.E 60.55,18.72 R_CUTOFF_BIAS1.1
OUT
  Bottom 0.508: SV_INOUT.5 SV_INOUT.3 3.47,29.45 3.47,37.03 9.27,42.84 TM_OUT.S
OUT_L_4TH  (via drill 0.6)
  Top 0.508: v79.71,48.99 66.22,48.99 v64.97,50.24 | C_CUTOFF_0.1 49.48,47.45 R_DIFF3.2
  Bottom 0.4: 58.86,52.2 DIFF_PAIR1.3
  Bottom 0.508: 58.86,52.2 58.86,48.2 58.46,47.8 C_CUTOFF_0.1 | DIFF_PAIR.4 v79.71,48.99 | v64.97,50.24 60.91,50.24 DIFF_PAIR1.3
OUT_R_4TH  (via drill 0.6)
  Top 0.4: v74.46,45.8 74.42,45.77
  Top 0.508: 74.42,45.77 72.45,45.77 71.69,45 v69.66,45
  Bottom 0.3: 82.12,56.08 77.8,56.08
  Bottom 0.4: R_DIFF1.2 54.92,45.31
  Bottom 0.508: 54.92,45.31 55.86,44.37 69.02,44.37 v69.66,45 | v74.46,45.8 74.46,45.73 76.4,43.78 | SL_4THORDER_STAGE0.2 76.4,43.78 | DIFF_PAIR1.6 DIFF_PAIR.1 76.53,57.35 77.8,56.08 | 76.4,43.78 76.55,43.78 77.8,45.03 80.88,45.03 84.98,49.13 84.98,53.23 82.12,56.08
Q2A_E
  Bottom 0.3: 49.73,53.54 55.7,53.54
  Bottom 0.508: DIFF_PAIR2.3 48.46,52.27 49.73,53.54 | DIFF_PAIR1.4 66.75,52.02 C_CUTOFF_1.1 66.75,46.69 65.61,45.54 57.45,45.54 56.23,46.76 56.23,53.02 55.7,53.54
Q2B_E
  Bottom 0.3: 68.45,56.08 64.42,56.08
  Bottom 0.4: SL_4THORDER_STAGE1.2 76.06,33.57
  Bottom 0.508: DIFF_PAIR2.6 DIFF_PAIR1.1 58.88,61.04 59.75,61.91 63.21,61.91 64.12,60.99 64.12,56.38 64.42,56.08 | 76.06,33.57 76.06,36.6 72.25,40.41 72.25,45.6 73.52,46.86 73.52,47.94 69.04,52.42 69.04,55.49 68.45,56.08
Q3A_E  (via drill 0.6)
  Top 0.508: v28.65,55.83 28.65,58.45 31.11,60.91 C_CUTOFF_2.1
  Bottom 0.508: v28.65,55.83 28.65,54.37 30.75,52.27 DIFF_PAIR3.3 31.45,50.11 34.11,47.45 43.33,47.45 46.46,50.57 48.84,50.57 50.55,52.27 DIFF_PAIR2.4
Q3B_E
  Bottom 0.508: DIFF_PAIR2.1 DIFF_PAIR3.6 39.07,59.39 C_CUTOFF_2.2
Q4A_E  (via drill 0.6)
  Top 0.508: v42.11,55.83 42.11,58.4 36.19,64.32 22.53,64.32 19.51,61.3 C_CUTOFF_3.1
  Bottom 0.508: C_CUTOFF_3.1 20.25,59.91 20.25,53.19 19.33,52.27 DIFF_PAIR4.3 | DIFF_PAIR3.4 40.16,52.27 42.11,54.23 v42.11,55.83
Q4B_E
  Bottom 0.4: C_CUTOFF_3.2 24.46,60.41 24.46,58.2 25.26,57.4 DIFF_PAIR4.6 25.66,57.4 | 31.26,57.4 DIFF_PAIR3.1
  Bottom 0.508: 25.66,57.4 31.26,57.4
STAGE0_L
  Top 0.4: 66.86,39 IC1.6 67.26,39 | C_CUTOFF_0.2 63.26,47.4 65.51,45.15 65.51,39.55
  Top 0.508: 66.86,39 66.06,39 65.51,39.55 | 67.26,39 76.54,39 78.94,41.41 SL_4THORDER_STAGE0.1
STAGE0_R
  Top 0.4: 67.26,40.2 IC1.7 | SL_4THORDER_STAGE0.3 73.66,41.8
  Top 0.508: 67.26,40.2 72.06,40.2 73.66,41.8
STAGE1_L
  Top 0.4: 67.18,35.15 IC1.3
  Top 0.508: 67.18,35.15 71.95,35.15 72.65,35.85 76.78,35.85 78.69,33.93 SL_4THORDER_STAGE1.3
STAGE1_R
  Top 0.4: 67.26,33.8 IC1.2 | SL_4THORDER_STAGE1.1 73.26,33.8
  Top 0.508: 73.26,33.8 67.26,33.8
  Bottom 0.508: C_CUTOFF_1.2 71.63,47.45 71.26,47.07 71.26,39.36 73.61,37.01 SL_4THORDER_STAGE1.1
SW_2ND_ORDER_A  (via drill 0.6)
  Top 0.4: 61.66,33.8 IC1.15
  Top 0.508: IC1.15 59.5,33.86 54.28,28.63 36.5,28.63 34.51,26.64 34.51,24.26 32.28,22.03 22.12,22.03 20.33,20.24 20.33,17.28 20.55,17.06 20.55,15.78 19.4,14.62 13.61,14.62 10.11,11.12 v10.11,6.68
  Bottom 0.508: v10.11,6.68 11.51,5.28 SL_2NDORDER_SW.3
SW_2ND_ORDER_B
  Top 0.4: 61.66,35 IC1.14
  Top 0.508: IC1.14 59.23,35.13 53.82,29.72 36.15,29.72 33.6,27.17 33.6,24.64 32.05,23.09 21.9,23.09 19,20.19 TM_CVRES_2ND.S
  Bottom 0.4: 21.26,11.4 TM_CVRES_2ND.E
  Bottom 0.508: TM_CVRES_2ND.S 19.21,16.21 24.08,16.21 24.08,14 TM_CVRES_2ND.E | SL_2NDORDER_SW.1 17.98,8.13 21.26,11.4
T_EXPCONV_B1
  Bottom 0.508: TM_CV_CUTOFF.S 59.39,17.42 58.83,16.87 58.83,12.75 60.07,11.51 EXPCONV_PAIR.2
T_EXPCONV_B2
  Bottom 0.508: TM_CUTOFF_BIAS.S 65.24,21 65.24,19.41 67.56,17.09 76.11,17.09 78.54,14.65 78.54,13.44 76.61,11.51 EXPCONV_PAIR.5
VIN
  Bottom 0.508: SV_INOUT.1 C_FB1.2
VIN_L
  Top 0.508: R_IN_BIAS_L.2 20.06,48.17 20.06,48.05 25.87,42.24 C_FB.2
  Bottom 0.508: R_IN_BIAS_L.2 19.76,48.72 20.78,49.73 26.68,49.73 28.02,51.07 28.02,53.47 26.68,54.81 DIFF_PAIR4.5 | ROUT1.2 32.08,42.24 C_FB.2
VIN_R
  Top 0.508: R_IN_BIAS_R.2 5.03,46.43 C_FB1.1
  Bottom 0.4: 17.77,54.6 DIFF_PAIR4.2
  Bottom 0.508: R_IN_BIAS_R.2 9.09,50.5 14.72,50.5 15.57,51.34 15.57,54.6 17.77,54.6

### Text on the board
Top: [TOP] | Lucas DT 2020 | VCF Ladder v1
Bottom: [BOT]